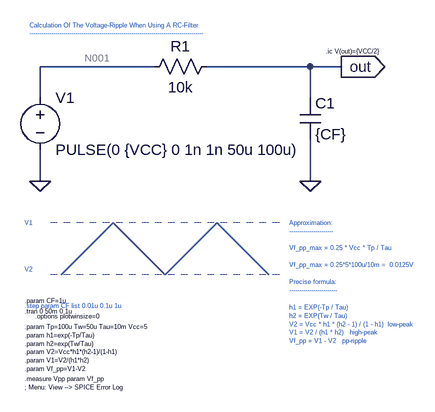
[diagram p0: schematic pwm_RC_filter.asc]
pwm_RC_filter.asc, the LTspice schematic file:
Version 4
SHEET 1 1608 796
WIRE 256 80 80 80
WIRE 496 80 336 80
WIRE 544 80 496 80
WIRE 80 128 80 80
WIRE 496 128 496 80
WIRE 80 256 80 208
WIRE 496 256 496 192
FLAG 496 256 0
FLAG 80 256 0
FLAG 544 80 out
IOPIN 544 80 Out
SYMBOL res 240 96 R270
WINDOW 0 32 56 VTop 2
WINDOW 3 0 56 VBottom 2
SYMATTR InstName R1
SYMATTR Value 10k
SYMBOL cap 480 128 R0
SYMATTR InstName C1
SYMATTR Value {CF}
SYMBOL voltage 80 112 R0
WINDOW 123 0 0 Left 2
WINDOW 39 0 0 Left 2
SYMATTR InstName V1
SYMATTR Value PULSE(0 {VCC} 0 1n 1n 50u 100u)
TEXT 56 456 Left 0 !.tran 0 50m 0 1u
TEXT 520 56 Left 0 !.ic V(out)={VCC/2}
TEXT 56 448 Left 0 ;.step param CF list 0.01u 0.1u 1u
TEXT 72 464 Left 0 !.options plotwinsize=0
TEXT 56 440 Left 0 !.param CF=1u
TEXT 464 320 Left 0 ;Approximation:\n----------------------\n \nVf_pp_max = 0.25 * Vcc * Tp / Tau\n \nVf_pp_max = 0.25*5*100u/10m =  0.0125V\n \nPrecise formula:\n------------------------\n \nh1 = EXP(-Tp / Tau)\nh2 = EXP(Tw / Tau)\nV2 = Vcc * h1 * (h2 - 1) / (1 - h1)  low-peak\nV1 = V2 / (h1 * h2)   high-peak\nVf_pp = V1 - V2   pp-ripple
TEXT 56 392 Left 0 ;V2
TEXT 56 320 Left 0 ;V1
TEXT 56 480 Left 0 !.param Tp=100u Tw=50u Tau=10m Vcc=5\n.param h1=exp(-Tp/Tau)\n.param h2=exp(Tw/Tau)\n.param V2=Vcc*h1*(h2-1)/(1-h1)\n.param V1=V2/(h1*h2)\n.param Vf_pp=V1-V2
TEXT 64 16 Left 0 ;Calculation Of The Voltage-Ripple When Using A RC-Filter\n---------------------------------------------------------------------------------------
TEXT 56 560 Left 0 !.measure Vpp param Vf_pp\n; Menu: View --> SPICE Error Log
LINE Normal 192 320 112 400
LINE Normal 272 400 192 320
LINE Normal 352 320 272 400
LINE Normal 432 400 352 320
LINE Normal 448 320 96 320 2
LINE Normal 448 400 96 400 2

The netlist it stands for:
* pwm_RC_filter.asc
R1 N001 out 10k
C1 out 0 {CF}
V1 N001 0 PULSE(0 {VCC} 0 1n 1n 50u 100u)
.tran 0 50m 0 1u
.ic V(out)={VCC/2}
* .step param CF list 0.01u 0.1u 1u
.options plotwinsize=0
.param CF=1u
* Approximation:
* ----------------------
* Vf_pp_max = 0.25 * Vcc * Tp / Tau
* Vf_pp_max = 0.25*5*100u/10m =  0.0125V
* Precise formula:
* ------------------------
* h1 = EXP(-Tp / Tau)
* h2 = EXP(Tw / Tau)
* V2 = Vcc * h1 * (h2 - 1) / (1 - h1)  low-peak
* V1 = V2 / (h1 * h2)   high-peak
* Vf_pp = V1 - V2   pp-ripple
* V2
* V1
.param Tp=100u Tw=50u Tau=10m Vcc=5
.param h1=exp(-Tp/Tau)
.param h2=exp(Tw/Tau)
.param V2=Vcc*h1*(h2-1)/(1-h1)
.param V1=V2/(h1*h2)
.param Vf_pp=V1-V2
* Calculation Of The Voltage-Ripple When Using A RC-Filter
* ---------------------------------------------------------------------------------------
.measure Vpp param Vf_pp
; Menu: View --> SPICE Error Log
.backanno
.end

* Results of the author's LTspice run, read from the files saved beside the schematic
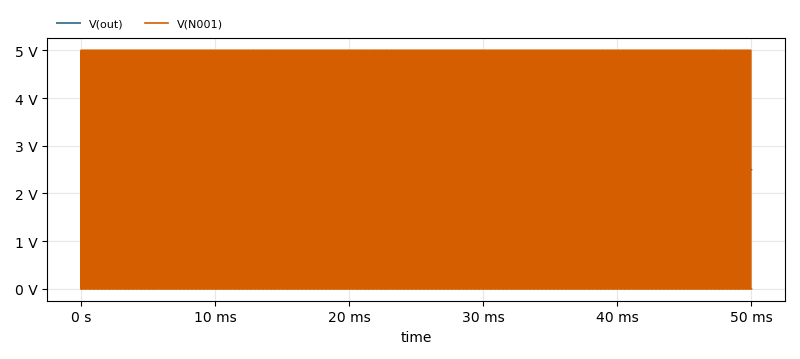
[diagram p1: Transient Analysis of pwm_RC_filter.asc, plotted from the saved traces]
* Transient Analysis, 1 run:
*   V(out): min 2.494 V, max 2.512 V, average 2.501 V, rms 2.501 V, last 2.494 V
*   V(N001): min 0 V, max 5 V, average 2.5 V, rms 3.536 V, last 0 V